# EAGLE schematic Precision Singleboard Charlieplex (EAGLE 6.1)
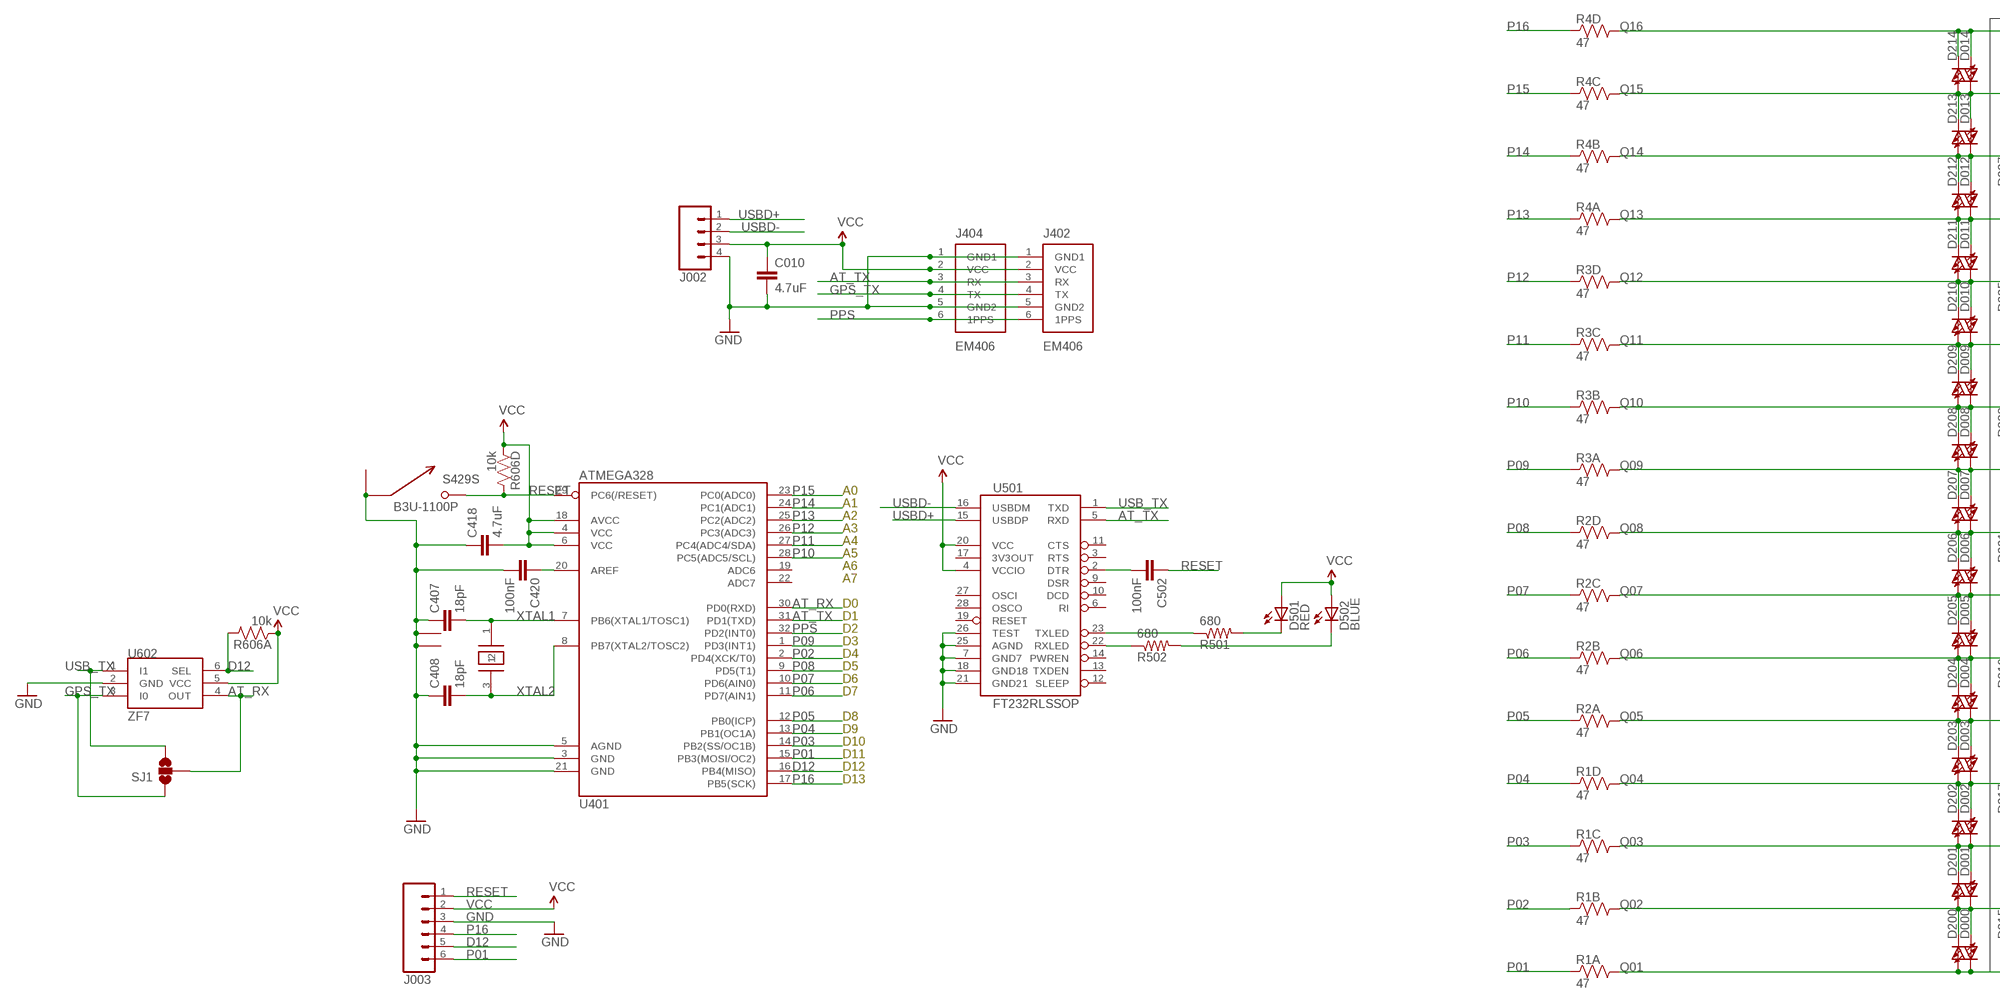
[diagram p0: schematic, sheet 1, part 1 of 2]
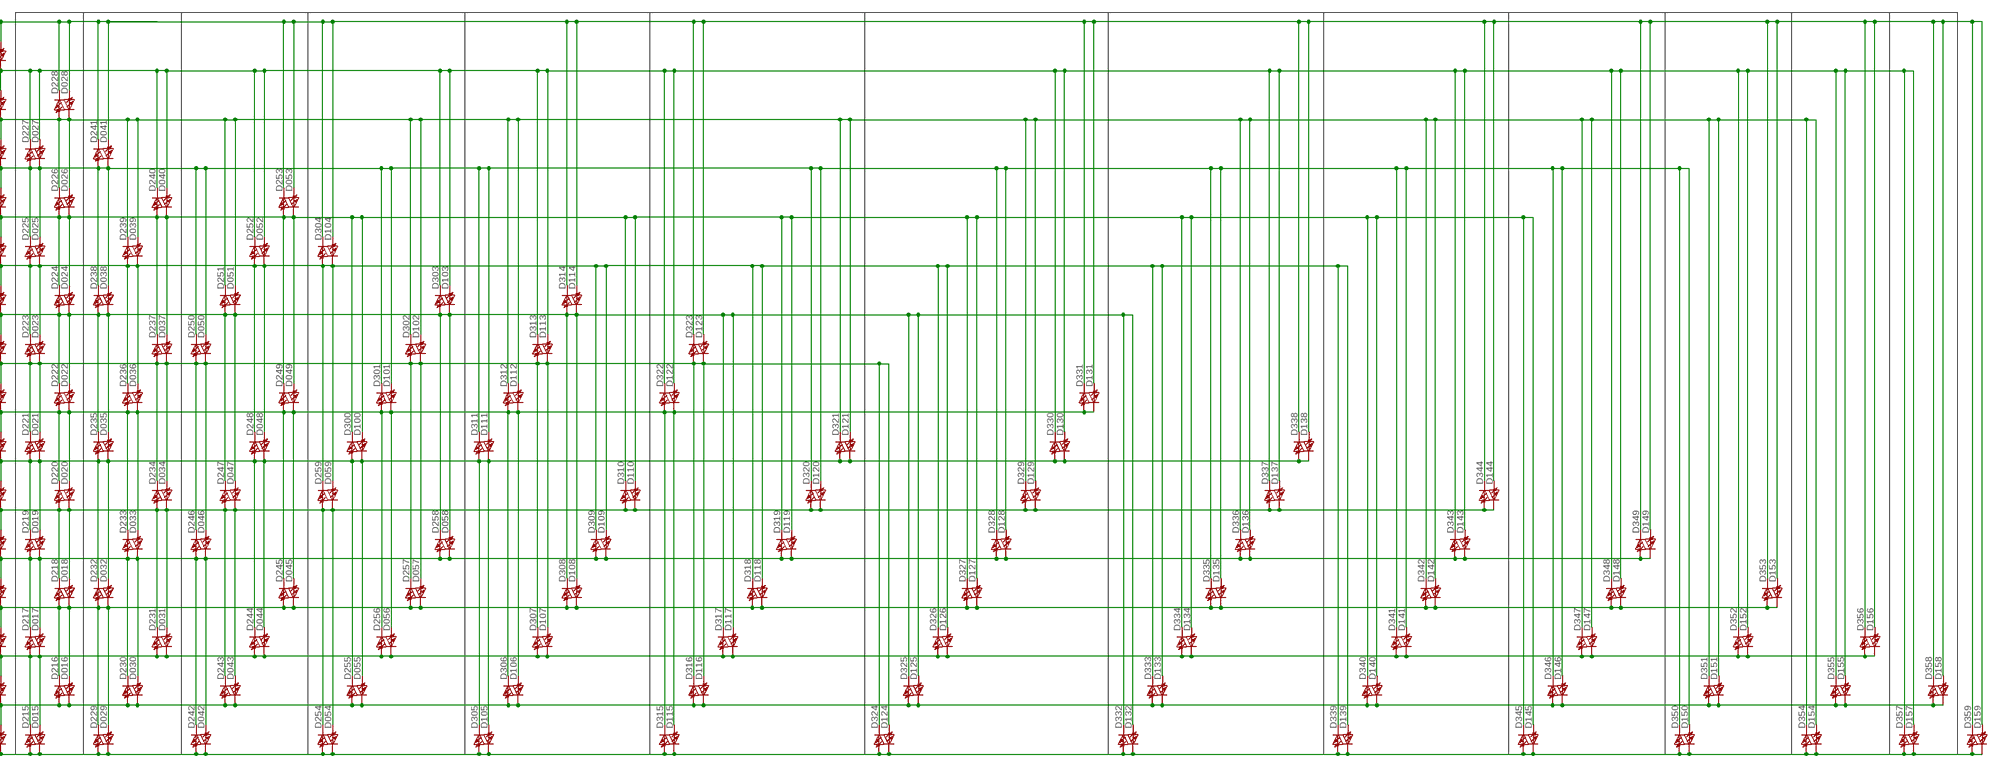
[diagram p1: schematic, sheet 1, part 2 of 2]

## Parts
C010  4.7uF  CAP0603-CAP  [0603-CAP]
C407  18pF  CAP0603-CAP  [0603-CAP]
C408  18pF  CAP0603-CAP  [0603-CAP]
C418  4.7uF  CAP0603-CAP  [0603-CAP]
C420  100nF  CAP0603-CAP  [0603-CAP]
C502  100nF  CAP0603-CAP  [0603-CAP]
D000  HOUR  LED0603  [LED-0603]
D001  HOUR  LED0603  [LED-0603]
D002  HOUR  LED0603  [LED-0603]
D003  HOUR  LED0603  [LED-0603]
D004  HOUR  LED0603  [LED-0603]
D005  HOUR  LED0603  [LED-0603]
D006  HOUR  LED0603  [LED-0603]
D007  HOUR  LED0603  [LED-0603]
D008  HOUR  LED0603  [LED-0603]
D009  HOUR  LED0603  [LED-0603]
D010  HOUR  LED0603  [LED-0603]
D011  HOUR  LED0603  [LED-0603]
D012  HOUR  LED0603  [LED-0603]
D013  HOUR  LED0603  [LED-0603]
D014  HOUR  LED0603  [LED-0603]
D015  HOUR  LED0603  [LED-0603]
D016  HOUR  LED0603  [LED-0603]
D017  HOUR  LED0603  [LED-0603]
D018  HOUR  LED0603  [LED-0603]
D019  HOUR  LED0603  [LED-0603]
D020  HOUR  LED0603  [LED-0603]
D021  HOUR  LED0603  [LED-0603]
D022  HOUR  LED0603  [LED-0603]
D023  HOUR  LED0603  [LED-0603]
D024  HOUR  LED0603  [LED-0603]
D025  HOUR  LED0603  [LED-0603]
D026  HOUR  LED0603  [LED-0603]
D027  HOUR  LED0603  [LED-0603]
D028  HOUR  LED0603  [LED-0603]
D029  HOUR  LED0603  [LED-0603]
D030  HOUR  LED0603  [LED-0603]
D031  HOUR  LED0603  [LED-0603]
D032  HOUR  LED0603  [LED-0603]
D033  HOUR  LED0603  [LED-0603]
D034  HOUR  LED0603  [LED-0603]
D035  HOUR  LED0603  [LED-0603]
D036  HOUR  LED0603  [LED-0603]
D037  HOUR  LED0603  [LED-0603]
D038  HOUR  LED0603  [LED-0603]
D039  HOUR  LED0603  [LED-0603]
D040  HOUR  LED0603  [LED-0603]
D041  HOUR  LED0603  [LED-0603]
D042  HOUR  LED0603  [LED-0603]
D043  HOUR  LED0603  [LED-0603]
D044  HOUR  LED0603  [LED-0603]
D045  HOUR  LED0603  [LED-0603]
D046  HOUR  LED0603  [LED-0603]
D047  HOUR  LED0603  [LED-0603]
D048  HOUR  LED0603  [LED-0603]
D049  HOUR  LED0603  [LED-0603]
D050  HOUR  LED0603  [LED-0603]
D051  HOUR  LED0603  [LED-0603]
D052  HOUR  LED0603  [LED-0603]
D053  HOUR  LED0603  [LED-0603]
D054  HOUR  LED0603  [LED-0603]
D055  HOUR  LED0603  [LED-0603]
D056  HOUR  LED0603  [LED-0603]
D057  HOUR  LED0603  [LED-0603]
D058  HOUR  LED0603  [LED-0603]
D059  HOUR  LED0603  [LED-0603]
D100  HOUR  LED0603  [LED-0603]
D101  HOUR  LED0603  [LED-0603]
D102  HOUR  LED0603  [LED-0603]
D103  HOUR  LED0603  [LED-0603]
D104  HOUR  LED0603  [LED-0603]
D105  HOUR  LED0603  [LED-0603]
D106  HOUR  LED0603  [LED-0603]
D107  HOUR  LED0603  [LED-0603]
D108  HOUR  LED0603  [LED-0603]
D109  HOUR  LED0603  [LED-0603]
D110  HOUR  LED0603  [LED-0603]
D111  HOUR  LED0603  [LED-0603]
D112  HOUR  LED0603  [LED-0603]
D113  HOUR  LED0603  [LED-0603]
D114  HOUR  LED0603  [LED-0603]
D115  HOUR  LED0603  [LED-0603]
D116  HOUR  LED0603  [LED-0603]
D117  HOUR  LED0603  [LED-0603]
D118  HOUR  LED0603  [LED-0603]
D119  HOUR  LED0603  [LED-0603]
D120  HOUR  LED0603  [LED-0603]
D121  HOUR  LED0603  [LED-0603]
D122  HOUR  LED0603  [LED-0603]
D123  HOUR  LED0603  [LED-0603]
D124  HOUR  LED0603  [LED-0603]
D125  HOUR  LED0603  [LED-0603]
D126  HOUR  LED0603  [LED-0603]
D127  HOUR  LED0603  [LED-0603]
D128  HOUR  LED0603  [LED-0603]
D129  HOUR  LED0603  [LED-0603]
D130  HOUR  LED0603  [LED-0603]
D131  HOUR  LED0603  [LED-0603]
D132  HOUR  LED0603  [LED-0603]
D133  HOUR  LED0603  [LED-0603]
D134  HOUR  LED0603  [LED-0603]
D135  HOUR  LED0603  [LED-0603]
D136  HOUR  LED0603  [LED-0603]
D137  HOUR  LED0603  [LED-0603]
D138  HOUR  LED0603  [LED-0603]
D139  HOUR  LED0603  [LED-0603]
D140  HOUR  LED0603  [LED-0603]
D141  HOUR  LED0603  [LED-0603]
D142  HOUR  LED0603  [LED-0603]
D143  HOUR  LED0603  [LED-0603]
D144  HOUR  LED0603  [LED-0603]
D145  HOUR  LED0603  [LED-0603]
D146  HOUR  LED0603  [LED-0603]
D147  HOUR  LED0603  [LED-0603]
D148  HOUR  LED0603  [LED-0603]
D149  HOUR  LED0603  [LED-0603]
D150  HOUR  LED0603  [LED-0603]
D151  HOUR  LED0603  [LED-0603]
D152  HOUR  LED0603  [LED-0603]
D153  HOUR  LED0603  [LED-0603]
D154  HOUR  LED0603  [LED-0603]
D155  HOUR  LED0603  [LED-0603]
D156  HOUR  LED0603  [LED-0603]
D157  HOUR  LED0603  [LED-0603]
D158  HOUR  LED0603  [LED-0603]
D159  HOUR  LED0603  [LED-0603]
D200  HOUR  LED0603  [LED-0603]
D201  HOUR  LED0603  [LED-0603]
D202  HOUR  LED0603  [LED-0603]
D203  HOUR  LED0603  [LED-0603]
D204  HOUR  LED0603  [LED-0603]
D205  HOUR  LED0603  [LED-0603]
D206  HOUR  LED0603  [LED-0603]
D207  HOUR  LED0603  [LED-0603]
D208  HOUR  LED0603  [LED-0603]
D209  HOUR  LED0603  [LED-0603]
D210  HOUR  LED0603  [LED-0603]
D211  HOUR  LED0603  [LED-0603]
D212  HOUR  LED0603  [LED-0603]
D213  HOUR  LED0603  [LED-0603]
D214  HOUR  LED0603  [LED-0603]
D215  HOUR  LED0603  [LED-0603]
D216  HOUR  LED0603  [LED-0603]
D217  HOUR  LED0603  [LED-0603]
D218  HOUR  LED0603  [LED-0603]
D219  HOUR  LED0603  [LED-0603]
D220  HOUR  LED0603  [LED-0603]
D221  HOUR  LED0603  [LED-0603]
D222  HOUR  LED0603  [LED-0603]
D223  HOUR  LED0603  [LED-0603]
D224  HOUR  LED0603  [LED-0603]
D225  HOUR  LED0603  [LED-0603]
D226  HOUR  LED0603  [LED-0603]
D227  HOUR  LED0603  [LED-0603]
D228  HOUR  LED0603  [LED-0603]
D229  HOUR  LED0603  [LED-0603]
D230  HOUR  LED0603  [LED-0603]
D231  HOUR  LED0603  [LED-0603]
D232  HOUR  LED0603  [LED-0603]
D233  HOUR  LED0603  [LED-0603]
D234  HOUR  LED0603  [LED-0603]
D235  HOUR  LED0603  [LED-0603]
D236  HOUR  LED0603  [LED-0603]
D237  HOUR  LED0603  [LED-0603]
D238  HOUR  LED0603  [LED-0603]
D239  HOUR  LED0603  [LED-0603]
D240  HOUR  LED0603  [LED-0603]
D241  HOUR  LED0603  [LED-0603]
D242  HOUR  LED0603  [LED-0603]
D243  HOUR  LED0603  [LED-0603]
D244  HOUR  LED0603  [LED-0603]
D245  HOUR  LED0603  [LED-0603]
D246  HOUR  LED0603  [LED-0603]
D247  HOUR  LED0603  [LED-0603]
D248  HOUR  LED0603  [LED-0603]
D249  HOUR  LED0603  [LED-0603]
D250  HOUR  LED0603  [LED-0603]
D251  HOUR  LED0603  [LED-0603]
D252  HOUR  LED0603  [LED-0603]
D253  HOUR  LED0603  [LED-0603]
D254  HOUR  LED0603  [LED-0603]
D255  HOUR  LED0603  [LED-0603]
D256  HOUR  LED0603  [LED-0603]
D257  HOUR  LED0603  [LED-0603]
D258  HOUR  LED0603  [LED-0603]
D259  HOUR  LED0603  [LED-0603]
D300  HOUR  LED0603  [LED-0603]
D301  HOUR  LED0603  [LED-0603]
D302  HOUR  LED0603  [LED-0603]
D303  HOUR  LED0603  [LED-0603]
D304  HOUR  LED0603  [LED-0603]
D305  HOUR  LED0603  [LED-0603]
D306  HOUR  LED0603  [LED-0603]
D307  HOUR  LED0603  [LED-0603]
D308  HOUR  LED0603  [LED-0603]
D309  HOUR  LED0603  [LED-0603]
D310  HOUR  LED0603  [LED-0603]
D311  HOUR  LED0603  [LED-0603]
D312  HOUR  LED0603  [LED-0603]
D313  HOUR  LED0603  [LED-0603]
D314  HOUR  LED0603  [LED-0603]
D315  HOUR  LED0603  [LED-0603]
D316  HOUR  LED0603  [LED-0603]
D317  HOUR  LED0603  [LED-0603]
D318  HOUR  LED0603  [LED-0603]
D319  HOUR  LED0603  [LED-0603]
D320  HOUR  LED0603  [LED-0603]
D321  HOUR  LED0603  [LED-0603]
D322  HOUR  LED0603  [LED-0603]
D323  HOUR  LED0603  [LED-0603]
D324  HOUR  LED0603  [LED-0603]
D325  HOUR  LED0603  [LED-0603]
D326  HOUR  LED0603  [LED-0603]
D327  HOUR  LED0603  [LED-0603]
D328  HOUR  LED0603  [LED-0603]
D329  HOUR  LED0603  [LED-0603]
D330  HOUR  LED0603  [LED-0603]
D331  HOUR  LED0603  [LED-0603]
D332  HOUR  LED0603  [LED-0603]
D333  HOUR  LED0603  [LED-0603]
D334  HOUR  LED0603  [LED-0603]
D335  HOUR  LED0603  [LED-0603]
D336  HOUR  LED0603  [LED-0603]
D337  HOUR  LED0603  [LED-0603]
D338  HOUR  LED0603  [LED-0603]
D339  HOUR  LED0603  [LED-0603]
D340  HOUR  LED0603  [LED-0603]
D341  HOUR  LED0603  [LED-0603]
D342  HOUR  LED0603  [LED-0603]
D343  HOUR  LED0603  [LED-0603]
D344  HOUR  LED0603  [LED-0603]
D345  HOUR  LED0603  [LED-0603]
D346  HOUR  LED0603  [LED-0603]
D347  HOUR  LED0603  [LED-0603]
D348  HOUR  LED0603  [LED-0603]
D349  HOUR  LED0603  [LED-0603]
D350  HOUR  LED0603  [LED-0603]
D351  HOUR  LED0603  [LED-0603]
D352  HOUR  LED0603  [LED-0603]
D353  HOUR  LED0603  [LED-0603]
D354  HOUR  LED0603  [LED-0603]
D355  HOUR  LED0603  [LED-0603]
D356  HOUR  LED0603  [LED-0603]
D357  HOUR  LED0603  [LED-0603]
D358  HOUR  LED0603  [LED-0603]
D359  HOUR  LED0603  [LED-0603]
D501  RED  LED0603  [LED-0603]
D502  BLUE  LED0603  [LED-0603]
J002  M04PTH  [1X04]
J003  M06SIP  [1X06]
J402  EM406  [EM406]
J404  EM406  [EM406]
R1  47  RP404  [CRA04]
R2  47  RP404  [CRA04]
R3  47  RP404  [CRA04]
R4  47  RP404  [CRA04]
R501  680  RESISTOR0603-RES  [0603-RES]
R502  680  RESISTOR0603-RES  [0603-RES]
R606  10k  RP404  [CRA04]
S429  B3U-1100P  [B3U-1100P]
SJ1  SOLDERJUMPER_2WAYS  [SJ_3]
U401  ATMEGA328  ATMEGA168  [TQFP32-08]
U501  FT232RLSSOP  [SSOP28DB]
U602  ZF7  NC7SZ157  [SC-70-6]
Y401  12.00  TSX-3225  [CRYSTAL_SMD]

## Nets
AREF: C420.1 U401.20(AREF)
AT_RX: SJ1.2 U401.30(PD0(RXD)) U602.4(OUT)
AT_TX: J402.3(RX) J404.3(RX) U401.31(PD1(TXD)) U501.5(RXD)
D12: J003.5 R606.8 U401.16(PB4(MISO)) U602.6(SEL)
GND [power]: C010.2 C407.1 C408.1 C418.1 C420.2 J002.4 J003.3 J402.1(GND1) J402.5(GND2) J404.1(GND1) J404.5(GND2) S429.P$1 S429.P$3 U401.3(GND) U401.5(AGND) U401.21(GND) U501.7(GND7) U501.18(GND18) U501.21(GND21) U501.25(AGND) U501.26(TEST) U602.2(GND) Y401.2 Y401.4
GPS_TX: J402.4(TX) J404.4(TX) SJ1.1 U602.3(I0)
N$3: C502.2 U501.2(DTR)
N$5: D501.C R501.2
N$6: R501.1 U501.23(TXLED)
N$7: R502.1 U501.22(RXLED)
N$8: D502.C R502.2
P01: J003.6 R1.1 U401.15(PB3(MOSI/OC2))
P02: R1.2 U401.2(PD4(XCK/T0))
P03: R1.3 U401.14(PB2(SS/OC1B))
P04: R1.4 U401.13(PB1(OC1A))
P05: R2.1 U401.12(PB0(ICP))
P06: R2.2 U401.11(PD7(AIN1))
P07: R2.3 U401.10(PD6(AIN0))
P08: R2.4 U401.9(PD5(T1))
P09: R3.1 U401.1(PD3(INT1))
P10: R3.2 U401.28(PC5(ADC5/SCL))
P11: R3.3 U401.27(PC4(ADC4/SDA))
P12: R3.4 U401.26(PC3(ADC3))
P13: R4.1 U401.25(PC2(ADC2))
P14: R4.2 U401.24(PC1(ADC1))
P15: R4.3 U401.23(PC0(ADC0))
P16: J003.4 R4.4 U401.17(PB5(SCK))
PPS: J402.6(1PPS) J404.6(1PPS) U401.32(PD2(INT0))
Q01: D000.C D015.C D029.C D042.C D054.C D105.C D115.C D124.C D132.C D139.C D145.C D150.C D154.C D157.C D159.C D200.A D215.A D229.A D242.A D254.A D305.A D315.A D324.A D332.A D339.A D345.A D350.A D354.A D357.A D359.A R1.8
Q02: D000.A D001.C D016.C D030.C D043.C D055.C D106.C D116.C D125.C D133.C D140.C D146.C D151.C D155.C D158.C D200.C D201.A D216.A D230.A D243.A D255.A D306.A D316.A D325.A D333.A D340.A D346.A D351.A D355.A D358.A R1.7
Q03: D001.A D002.C D015.A D017.C D031.C D044.C D056.C D107.C D117.C D126.C D134.C D141.C D147.C D152.C D156.C D201.C D202.A D215.C D217.A D231.A D244.A D256.A D307.A D317.A D326.A D334.A D341.A D347.A D352.A D356.A R1.6
Q04: D002.A D003.C D016.A D018.C D029.A D032.C D045.C D057.C D108.C D118.C D127.C D135.C D142.C D148.C D153.C D202.C D203.A D216.C D218.A D229.C D232.A D245.A D257.A D308.A D318.A D327.A D335.A D342.A D348.A D353.A R1.5
Q05: D003.A D004.C D017.A D019.C D030.A D033.C D042.A D046.C D058.C D109.C D119.C D128.C D136.C D143.C D149.C D203.C D204.A D217.C D219.A D230.C D233.A D242.C D246.A D258.A D309.A D319.A D328.A D336.A D343.A D349.A R2.8
Q06: D004.A D005.C D018.A D020.C D031.A D034.C D043.A D047.C D054.A D059.C D110.C D120.C D129.C D137.C D144.C D204.C D205.A D218.C D220.A D231.C D234.A D243.C D247.A D254.C D259.A D310.A D320.A D329.A D337.A D344.A R2.7
Q07: D005.A D006.C D019.A D021.C D032.A D035.C D044.A D048.C D055.A D100.C D105.A D111.C D121.C D130.C D138.C D205.C D206.A D219.C D221.A D232.C D235.A D244.C D248.A D255.C D300.A D305.C D311.A D321.A D330.A D338.A R2.6
Q08: D006.A D007.C D020.A D022.C D033.A D036.C D045.A D049.C D056.A D101.C D106.A D112.C D115.A D122.C D131.C D206.C D207.A D220.C D222.A D233.C D236.A D245.C D249.A D256.C D301.A D306.C D312.A D315.C D322.A D331.A R2.5
Q09: D007.A D008.C D021.A D023.C D034.A D037.C D046.A D050.C D057.A D102.C D107.A D113.C D116.A D123.C D124.A D207.C D208.A D221.C D223.A D234.C D237.A D246.C D250.A D257.C D302.A D307.C D313.A D316.C D323.A D324.C R3.8
Q10: D008.A D009.C D022.A D024.C D035.A D038.C D047.A D051.C D058.A D103.C D108.A D114.C D117.A D125.A D132.A D208.C D209.A D222.C D224.A D235.C D238.A D247.C D251.A D258.C D303.A D308.C D314.A D317.C D325.C D332.C R3.7
Q11: D009.A D010.C D023.A D025.C D036.A D039.C D048.A D052.C D059.A D104.C D109.A D118.A D126.A D133.A D139.A D209.C D210.A D223.C D225.A D236.C D239.A D248.C D252.A D259.C D304.A D309.C D318.C D326.C D333.C D339.C R3.6
Q12: D010.A D011.C D024.A D026.C D037.A D040.C D049.A D053.C D100.A D110.A D119.A D127.A D134.A D140.A D145.A D210.C D211.A D224.C D226.A D237.C D240.A D249.C D253.A D300.C D310.C D319.C D327.C D334.C D340.C D345.C R3.5
Q13: D011.A D012.C D025.A D027.C D038.A D041.C D050.A D101.A D111.A D120.A D128.A D135.A D141.A D146.A D150.A D211.C D212.A D225.C D227.A D238.C D241.A D250.C D301.C D311.C D320.C D328.C D335.C D341.C D346.C D350.C R4.8
Q14: D012.A D013.C D026.A D028.C D039.A D051.A D102.A D112.A D121.A D129.A D136.A D142.A D147.A D151.A D154.A D212.C D213.A D226.C D228.A D239.C D251.C D302.C D312.C D321.C D329.C D336.C D342.C D347.C D351.C D354.C R4.7
Q15: D013.A D014.C D027.A D040.A D052.A D103.A D113.A D122.A D130.A D137.A D143.A D148.A D152.A D155.A D157.A D213.C D214.A D227.C D240.C D252.C D303.C D313.C D322.C D330.C D337.C D343.C D348.C D352.C D355.C D357.C R4.6
Q16: D014.A D028.A D041.A D053.A D104.A D114.A D123.A D131.A D138.A D144.A D149.A D153.A D156.A D158.A D159.A D214.C D228.C D241.C D253.C D304.C D314.C D323.C D331.C D338.C D344.C D349.C D353.C D356.C D358.C D359.C R4.5
RESET: C502.1 J003.1 R606.5 S429.P$2 U401.29(PC6(/RESET))
USB_TX: SJ1.3 U501.1(TXD) U602.1(I1)
USBD+: J002.1 U501.15(USBDP)
USBD-: J002.2 U501.16(USBDM)
VCC [power]: C010.1 C418.2 D501.A D502.A J002.3 J003.2 J402.2(VCC) J404.2(VCC) R606.1 R606.4 U401.4(VCC) U401.6(VCC) U401.18(AVCC) U501.4(VCCIO) U501.20(VCC) U602.5(VCC)
XTAL1: C407.2 U401.7(PB6(XTAL1/TOSC1)) Y401.1
XTAL2: C408.2 U401.8(PB7(XTAL2/TOSC2)) Y401.3
Unconnected: R606.2 R606.3 R606.6 R606.7 U401.19(ADC6) U401.22(ADC7) U501.3(RTS) U501.6(RI) U501.9(DSR) U501.10(DCD) U501.11(CTS) U501.12(SLEEP) U501.13(TXDEN) U501.14(PWREN) U501.17(3V3OUT) U501.19(RESET) U501.27(OSCI) U501.28(OSCO)

## Notes on the sheet
- A0
- A1
- A2
- A3
- A4
- A5
- A6
- A7
- D0
- D1
- D2
- D3
- D4
- D5
- D6
- D7
- D8
- D9
- D10
- D11
- D12
- D13

## Library data of the parts
C010 C407 C408 C418 C420 C502 = SparkFun:CAP: Capacitor Standard 0603 ceramic capacitor, and 0.1" leaded capacitor.
D000 D001-D009 D010-D059 D100-D159 D200-D259 D300-D359 D501 D502 = SparkFun:LED: LEDs Standard schematic elements and footprints for 5mm, 3mm, 1206, and 0603 sized LEDs. 5mm - Spark Fun Electronics SKU : COM-00529 (and others)
J002 = SparkFun:M04: Header 4 Standard 4-pin 0.1" header. Use with straight break away headers (SKU : PRT-00116), right angle break away headers (PRT-00553), swiss pins (PRT-00743), machine pins (PRT-00117), and female headers (PRT-00115). Molex polarized connector foot print use with SKU : PRT-08231 with associated crimp pins and housings. 1MM SMD Version SKU: PRT-10208
J003 = SparkFun:M06: Header 6 Standard 6-pin 0.1" header. Use with straight break away headers (SKU : PRT-00116), right angle break away headers (PRT-00553), swiss pins (PRT-00743), machine pins (PRT-00117), and female headers (PRT-00115). Molex polarized connector foot print use with SKU : PRT-08094 with associated crimp pins and housings. NOTES ON THE VARIANTS LOCK and LOCK_LONGPADS... This footprint was designed to help hold the alignment of a through-hole component (i.e. 6-pin header) while soldering it into place. You may notice that each hole has been shifted either up or down by 0.005 of an inch from it's more standard position (which is a perfectly straight line). This slight alteration caused the pins (the squares in the middle) to touch the edges of the holes. Because they are alternating, it causes a "brace" to hold the component in place. 0.005 has proven to be the perfect amount of "off-center" position when using our standard breakaway headers. Although looks a little odd when you look at the bare footprint, once you have a header in there, the alteration is very hard to notice. Also, if you push a header all the way into place, it is covered up entirely on the bottom side. This idea of altering the position of holes to aid alignment will be further integrated into the Sparkfun Library for other footprints. It can help hold any component with 3 or more connection pins.
J402 J404 = SparkFun:EM406: EM406 Connector Proven layout and schematic for EM406 connector. Spark Fun Electronics SKU : GPS-00579
R1-R4 R606 = KwanSystems:RP4
R501 R502 = SparkFun:RESISTOR: Resistor Basic schematic elements and footprints for 0603, 1206, and PTH resistors.
S429 = KwanSystems:B3U-1100P
SJ1 = SparkFun:SOLDERJUMPER_2WAY: Solder Jumper 2 way solder jumper
U401 = SparkFun:ATMEGA168
U501 = SparkFun:FT232RL: USB UART FT232RL 4th Generation USB UART (USB <-> Serial) Controller. Spark Fun Electronics SKU : COM-00650
U602 = KwanSystems:NC7SZ157
Y401 = KwanSystems:TSX-3225

## Net classes
0 default: width 0.152 mm, drill 0.33 mm, clearance 0.152 mm
1 power: width 0.152 mm, drill 0.33 mm, clearance 0.152 mm